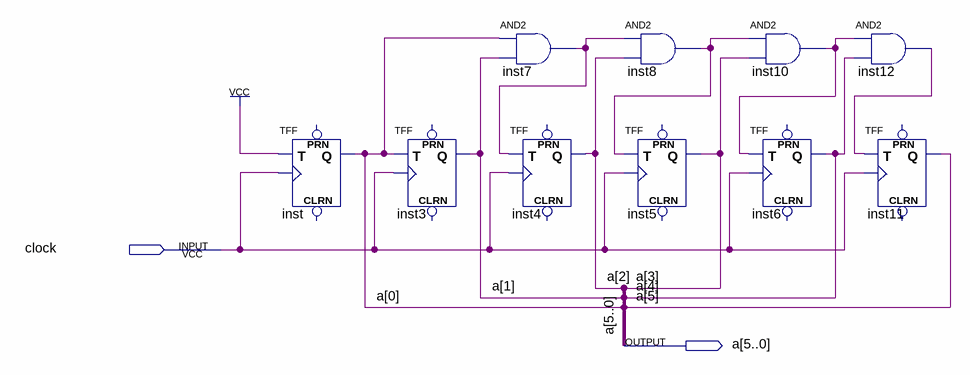
[diagram p0: schematic sheet]
// Quartus schematic contador.bdf as structural Verilog: 10 symbols, 2 pins
module contador (
  input  clock,
  output [5:0] a
);

  wire inst7_out, inst8_out, inst10_out, inst12_out;

  TFF inst (.T(1'b1), .CLK(clock), .Q(a[0]));  // open: PRN, CLRN
  TFF inst3 (.T(a[0]), .CLK(clock), .Q(a[1]));  // open: PRN, CLRN
  and inst7 (inst7_out, a[0], a[1]);
  TFF inst4 (.T(inst7_out), .CLK(clock), .Q(a[2]));  // open: PRN, CLRN
  and inst8 (inst8_out, inst7_out, a[2]);
  TFF inst5 (.T(inst8_out), .CLK(clock), .Q(a[3]));  // open: PRN, CLRN
  and inst10 (inst10_out, inst8_out, a[3]);
  TFF inst6 (.T(inst10_out), .CLK(clock), .Q(a[4]));  // open: PRN, CLRN
  and inst12 (inst12_out, inst10_out, a[4]);
  TFF inst11 (.T(inst12_out), .CLK(clock), .Q(a[5]));  // open: PRN, CLRN
endmodule
